# Altium schematic sheet Test_Points_SCH.SchDoc
size A
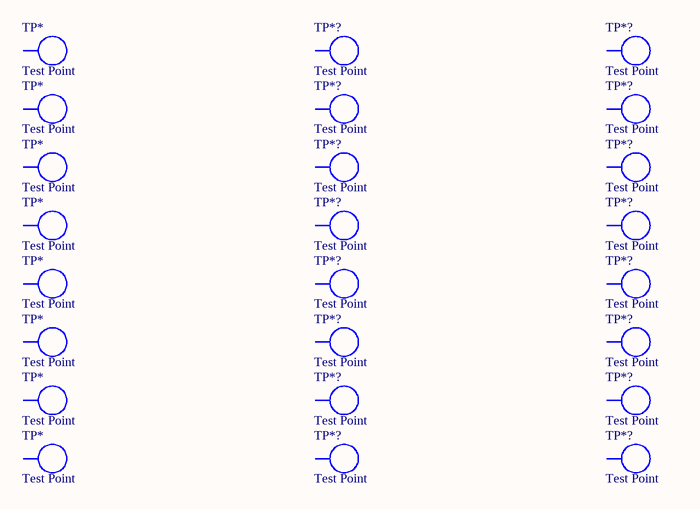
[diagram p0: Test_Points_SCH.SchDoc]

## Parts
(Parts that share a designator on the sheet are numbered #1, #2 ... from top to bottom, then left to right.)
TP*#1  Test Point
TP*#2  Test Point
TP*#3  Test Point
TP*#4  Test Point
TP*#5  Test Point
TP*#6  Test Point
TP*#7  Test Point
TP*#8  Test Point
TP*?#1  Test Point
TP*?#2  Test Point
TP*?#3  Test Point
TP*?#4  Test Point
TP*?#5  Test Point
TP*?#6  Test Point
TP*?#7  Test Point
TP*?#8  Test Point
TP*?#9  Test Point
TP*?#10  Test Point
TP*?#11  Test Point
TP*?#12  Test Point
TP*?#13  Test Point
TP*?#14  Test Point
TP*?#15  Test Point
TP*?#16  Test Point